# Altium schematic sheet [4] - POWER (CONT).SchDoc: REGULATORS
size B; Organization: Altium Limited; Address1: L3, 12a Rodborough Rd; Address2: Frenchs Forest; Address3: NSW; Address4: Australia 2086; DocumentNumber: 4; Revision: V1I1; SheetNumber: 4; SheetTotal: 16
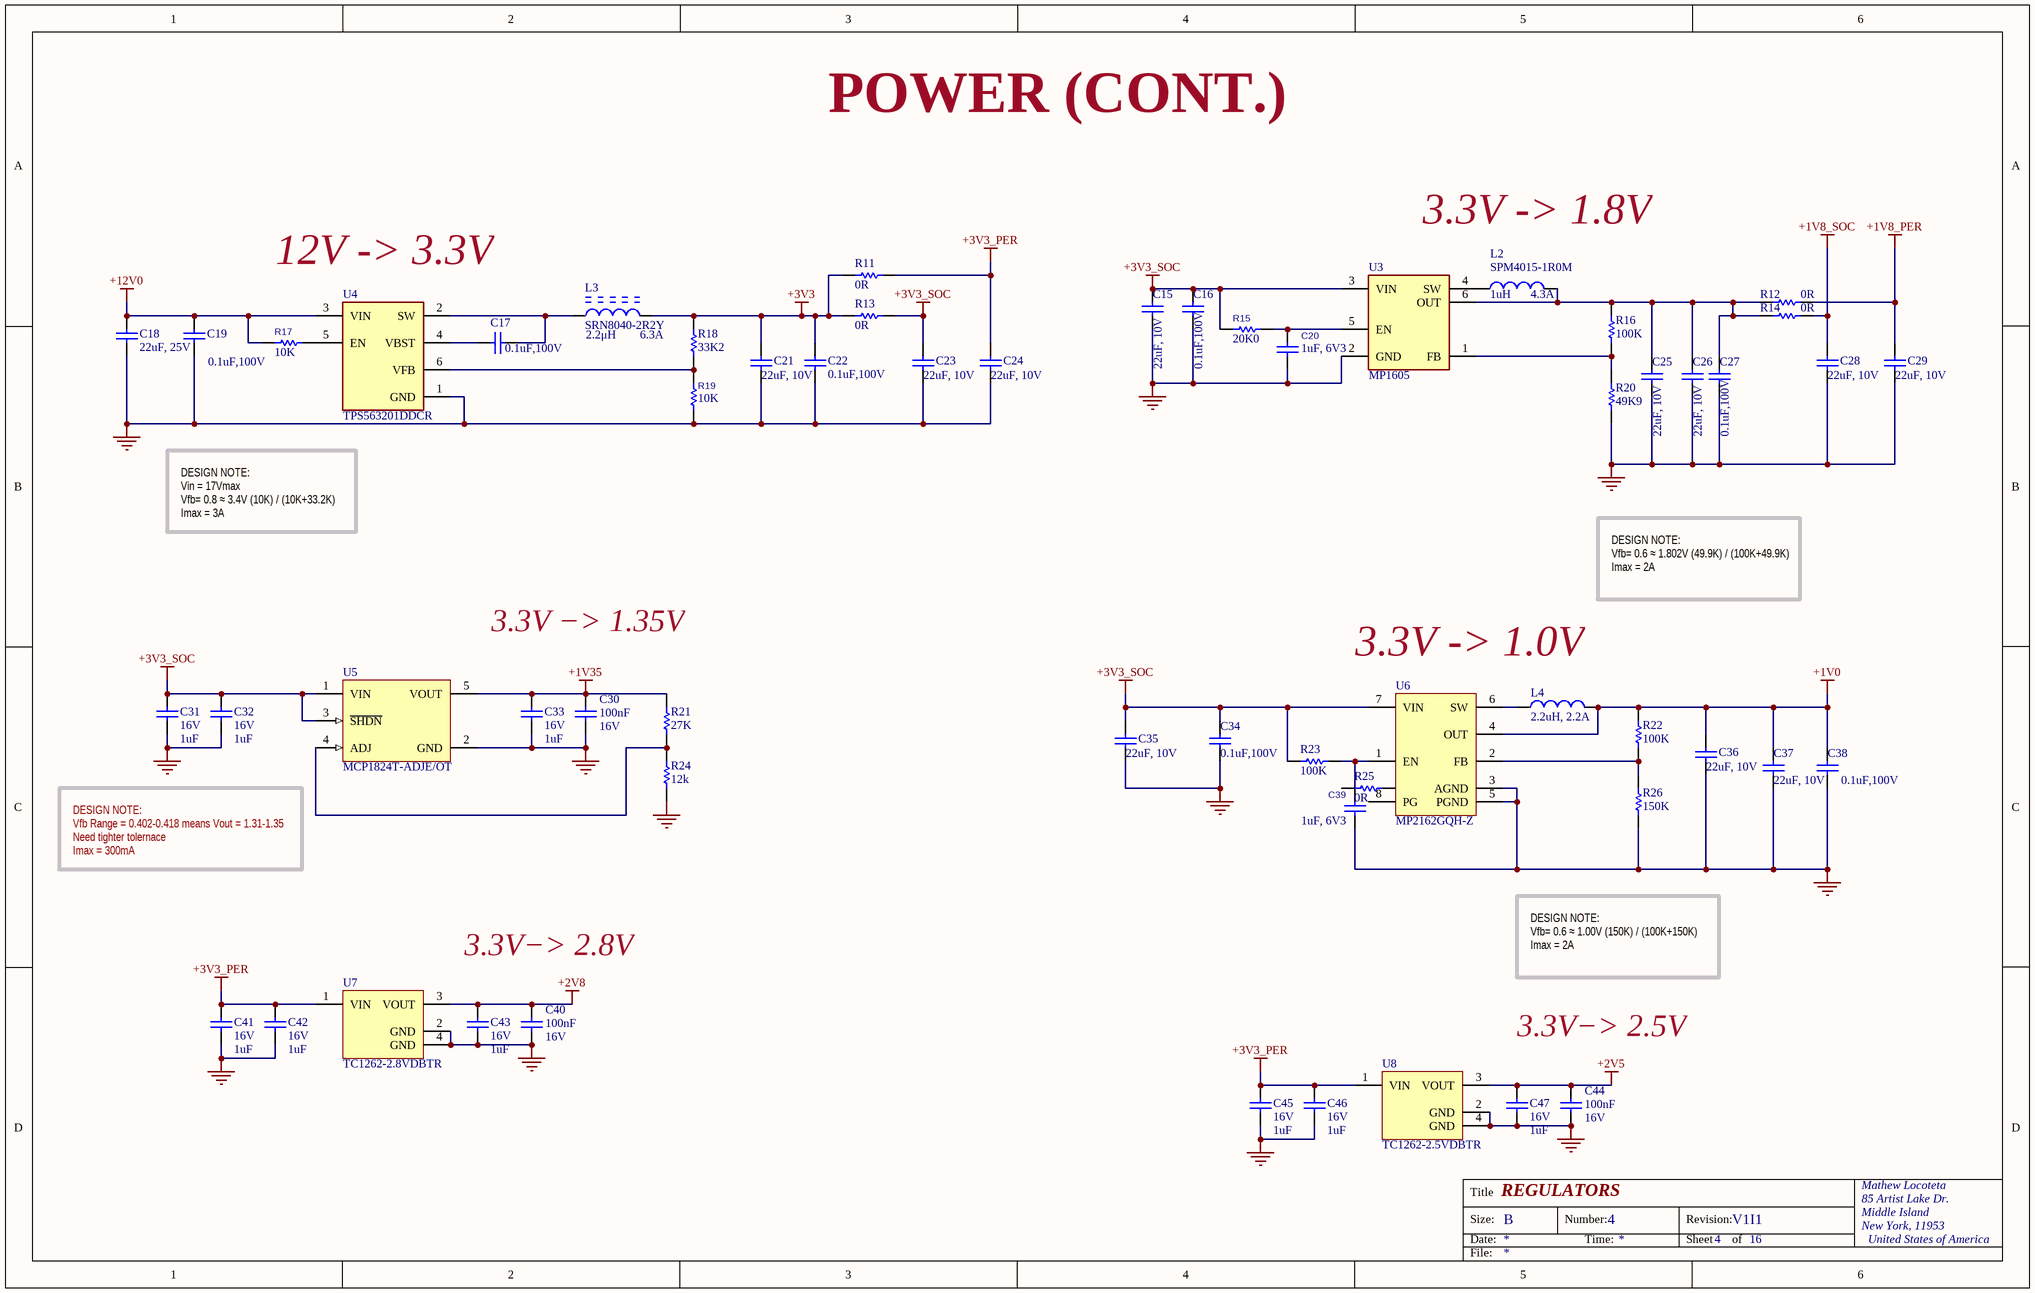
[diagram p0: [4] - POWER (CONT).SchDoc]

## Parts
C15  22uF, 10V  [C0805]
C16  0.1uF,100V  [C0805]
C17  0.1uF,100V  [C0805]
C18  22uF, 25V  [C1210]
C19  0.1uF,100V  [C0805]
C20  1uF, 6V3  [C0402]
C21  22uF, 10V  [C0805]
C22  0.1uF,100V  [C0805]
C23  22uF, 10V  [C0805]
C24  22uF, 10V  [C0805]
C25  22uF, 10V  [C0805]
C26  22uF, 10V  [C0805]
C27  0.1uF,100V  [C0805]
C28  22uF, 10V  [C0805]
C29  22uF, 10V  [C0805]
C30  Capacitance: 100nF  Voltage Rating: 16V  [C0402]  (hidden comment: 0.1uF,16V)
C31  Voltage Rating: 16V  [C0603]  (hidden comment: 1uF)
C32  Voltage Rating: 16V  [C0603]  (hidden comment: 1uF)
C33  Voltage Rating: 16V  [C0603]  (hidden comment: 1uF)
C34  0.1uF,100V  [C0805]
C35  22uF, 10V  [C0805]
C36  22uF, 10V  [C0805]
C37  22uF, 10V  [C0805]
C38  0.1uF,100V  [C0805]
C39  1uF, 6V3  [C0402]
C40  Capacitance: 100nF  Voltage Rating: 16V  [C0402]  (hidden comment: 0.1uF,16V)
C41  Voltage Rating: 16V  [C0603]  (hidden comment: 1uF)
C42  Voltage Rating: 16V  [C0603]  (hidden comment: 1uF)
C43  Voltage Rating: 16V  [C0603]  (hidden comment: 1uF)
C44  Capacitance: 100nF  Voltage Rating: 16V  [C0402]  (hidden comment: 0.1uF,16V)
C45  Voltage Rating: 16V  [C0603]  (hidden comment: 1uF)
C46  Voltage Rating: 16V  [C0603]  (hidden comment: 1uF)
C47  Voltage Rating: 16V  [C0603]  (hidden comment: 1uF)
L2  SPM4015-1R0M  Inductance: 1uH  Current Rating: 4.3A
L3  SRN8040-2R2Y  Current, Rating: 6.3A  Inductance: 2.2μH  [BOUR-SRN8040_V]
L4  2.2uH, 2.2A
R11  0R  [r0805]
R12  0R  [r0805]
R13  0R  [r0805]
R14  0R  [r0805]
R15  20K0  [R0402]
R16  100K  [R0402]
R17  10K  [R0402]
R18  33K2  [R0402]
R19  10K  [R0402]
R20  49K9  [R0402]
R21  27K  [RESC1005X40X25ML05T05]
R22  Resistance: 100K  [RESC1005X40X25LL05T05]  (hidden comment: ERJ-2RKF1003X)
R23  100K  [R0402]
R24  12k  [RESC1005X40X25NL05T05]
R25  0R  [r0805]
R26  150K  [R0402]
U3  MP1605
U4  TPS563201DDCR
U5  MCP1824T-ADJE/OT  [SOT-23-OT5_M]
U6  MP2162GQH-Z
U7  TC1262-2.8VDBTR  [SOT-223-DB3_N]
U8  TC1262-2.5VDBTR  [SOT-223-DB3_M]

## Nets
+1V0: C36.2 C37.2 C38.2 L4.2 R22.2 U6.4(OUT)
+1V8_PER: C29.2 R12.2
+1V8_SOC: C28.2 R14.2
+1V35: C30.1 C33.2 R21.2 U5.5(VOUT)
+2V5: C44.1 C47.2 U8.3(VOUT)
+2V8: C40.1 C43.2 U7.3(VOUT)
+3V3: C21.2 C22.1 L3.2 R11.2 R13.2 R18.2
+3V3_PER: C24.2 C41.2 C42.2 C45.2 C46.2 R11.1 U7.1(VIN) U8.1(VIN)
+3V3_SOC: C15.2 C16.1 C23.2 C31.2 C32.2 C34.1 C35.2 R13.1 R15.2 R23.1 U3.3(VIN) U5.1(VIN) U5.3(~{SHDN}) U6.7(VIN)
+12V0: C18.2 C19.2 R17.1 U4.3(VIN)
GND: C15.1 C16.2 C18.1 C19.1 C20.1 C21.1 C22.2 C23.1 C24.1 C25.1 C26.1 C27.2 C28.1 C29.1 C30.2 C31.1 C32.1 C33.1 C34.2 C35.1 C36.1 C37.1 C38.1 C39.1 C40.2 C41.1 C42.1 C43.1 C44.2 C45.1 C46.1 C47.1 R19.1 R20.1 R24.1 R26.1 U3.2(GND) U4.1(GND) U5.2(GND) U6.3(AGND) U6.5(PGND) U7.2(GND) U7.4(GND) U8.2(GND) U8.4(GND)
NetC17_1: C17.1 L3.1 U4.2(SW)
NetC17_2: C17.2 U4.4(VBST)
NetC20_2: C20.2 R15.1 U3.5(EN)
NetC25_2: C25.2 C26.2 C27.1 L2.2 R12.1 R14.1 R16.2 U3.6(OUT)
NetC39_2: C39.2 R23.2 U6.1(EN)
NetL2_1: L2.1 U3.4(SW)
NetL4_1: L4.1 U6.6(SW)
NetR16_1: R16.1 R20.2 U3.1(FB)
NetR17_2: R17.2 U4.5(EN)
NetR18_1: R18.1 R19.2 U4.6(VFB)
NetR21_1: R21.1 R24.2 U5.4(ADJ)
NetR22_1: R22.1 R26.2 U6.2(FB)

Not connected (* = marked no-connect by the designer): R25 1 2; U6 8(PG)

## Notes on the sheet
- POWER (CONT.)
- 3.3V -> 1.8V
- (near U4) 12V -> 3.3V
- DESIGN NOTE:
  Vin = 17Vmax
  Vfb= 0.8 ≈ 3.4V (10K) / (10K+33.2K)
  Imax = 3A
- 3.3V −> 1.35V
- DESIGN NOTE:
  Vfb= 0.6 ≈ 1.802V (49.9K) / (100K+49.9K)
  Imax = 2A
- 3.3V -> 1.0V
- DESIGN NOTE:
  Vfb Range = 0.402-0.418 means Vout = 1.31-1.35
  Need tighter tolernace
  Imax = 300mA
- 3.3V−> 2.8V
- DESIGN NOTE:
  Vfb= 0.6 ≈ 1.00V (150K) / (100K+150K)
  Imax = 2A
- 3.3V−> 2.5V
- Title
- Size:
- Date:
- B
- Number:
- Time:
- Revision:
- Sheet
- of
- Mathew Locoteta
- 85 Artist Lake Dr.
- Middle Island
- New York, 11953
- United States of America
- File:

## Library data of the parts
C15 C21 C23-C26 C28 C29 C35-C37 = GRM21BR61A226ME51L: MURATA - GRM21BR61A226ME51L - CAP, MLCC, X5R, 22UF, 10V, 0805; Tolerance: 20%; Supplier 1: Digi-Key; Manufacturer: Murata; Manufacturer Part Number: GRM21BR61A226ME51L; RoHS: Yes; Category: Ceramic Capacitors; Stock 1: 2854415; Pricing 1: 1=0.36000, 10=0.24400, 100=0.13810, 500=0.09746, 1000=0.08529 (USD); Mount: Surface Mount; Case/Package: 0805; Weight: 0.000335oz; Case Code (Imperial): 0805; Case Code (Metric): 2012; Min Operating Temperature: -55°C; Max Operating Temperature: 85°C; Dielectric: X5R; Termination: SMD/SMT; Voltage Rating (DC): 10V; Package Quantity: 3000; Capacitance: 22uF; Packaging: Tape and Reel; Voltage Rating: 10V; Length: 2mm; Height: 1.25mm; Width: 0.049inch; Thickness: 0.055inch; Depth: 1.25mm; Radiation Hardening: No; Lead Free: Lead Free; REACH SVHC: No SVHC; ComponentLink1URL: http://www.farnell.com/datasheets/1955716.pdf?src-supplier=Farnell; ComponentLink1Description: http://www.farnell.com/datasheets/1955716.pdf?src-supplier=Farnell; ComponentLink2URL: http://components.arrow.com/part/dataview/0323_06961245?src-supplier=Arrow+Europe; ComponentLink2Description: http://components.arrow.com/part/dataview/0323_06961245?src-supplier=Arrow+Europe; ComponentLink3URL: http://www.mouser.com/ds/2/281/c02e-2905.pdf?src-supplier=Mouser; ComponentLink3Description: http://www.mouser.com/ds/2/281/c02e-2905.pdf?src-supplier=Mouser; ComponentLink4URL: http://psearch.en.murata.com/capacitor/product/GRM21BR61A226ME51%23.html?src-supplier=Avnet; ComponentLink4Description: http://psearch.en.murata.com/capacitor/product/GRM21BR61A226ME51%23.html?src-supplier=Avnet; ComponentLink5URL: http://www.farnell.com/datasheets/1955716.pdf?src-supplier=Element14; ComponentLink5Description: http://www.farnell.com/datasheets/1955716.pdf?src-supplier=Element14; ComponentLink6URL: http://search.murata.co.jp/Ceramy/image/img/A01X/G101/ENG/GRM21BR61A226ME51-01.pdf?src-supplier=Digi-Key; ComponentLink6Description: http://search.murata.co.jp/Ceramy/image/img/A01X/G101/ENG/GRM21BR61A226ME51-01.pdf?src-supplier=Digi-Key; ComponentLink7URL: http://www.farnell.com/datasheets/1955716.pdf?src-supplier=Newark; ComponentLink7Description: http://www.farnell.com/datasheets/1955716.pdf?src-supplier=Newark; Supplier Part Number 1: 490-10511-6-ND
C16 C17 C19 C22 C27 C34 C38 = CL21B104KCFWPNE: CAP CER 0.1UF 100V X7R 0805; Manufacturer: Samsung; Capacitance: 100nF; Tolerance: 10%; Supplier 1: Digi-Key; Manufacturer Part Number: CL21B104KCFWPNE; Stock 1: 283289; Pricing 1: 1=0.16000, 10=0.11200, 100=0.05250, 500=0.03684, 1000=0.03050 (USD); RoHS: Yes; Mount: Surface Mount; Case/Package: 0805; Case Code (Metric): 2012; Case Code (Imperial): 0805; Min Operating Temperature: -55°C; Max Operating Temperature: 125°C; Packaging: Tape and Reel; Voltage Rating: 100V; Features: Soft Termination; Length: 0.079inch; Width: 0.049inch; Thickness: 0.053inch; Ratings: AEC-Q200; ComponentLink1URL: http://www.samsungsem.com/servlet/FileDownload?type=spec&file=CL21B104KCFWPNE.pdf&src-supplier=Avnet; ComponentLink1Description: http://www.samsungsem.com/servlet/FileDownload?type=spec&file=CL21B104KCFWPNE.pdf&src-supplier=Avnet; ComponentLink2URL: http://www.samsungsem.com/kr/support/product-search/mlcc/CL21B104KCFWPNE.jsp?src-supplier=Digi-Key; ComponentLink2Description: http://www.samsungsem.com/kr/support/product-search/mlcc/CL21B104KCFWPNE.jsp?src-supplier=Digi-Key; Supplier Part Number 1: 1276-6733-1-ND
C18 = TMK325B7226MMHP: 22µF ±20% 25V Ceramic Capacitor X7R 1210 (3225 Metric) /; Manufacturer: Taiyo Yuden; Supplier 1: Digi-Key; Manufacturer Part Number: TMK325B7226MMHP; RoHS: No; Stock 1: 1378; Pricing 1: 1=0.84000, 10=0.64100, 100=0.45870, 500=0.35514 (USD); Supplier Part Number 1: 587-TMK325B7226MMHPCT-ND
C20 C39 = GRT155R70J105KE01D: MURATA - GRT155R70J105KE01D - CAP, 1µF, 6.3V, 10%, X7R, 0402; Supplier 1: Digi-Key; Manufacturer: Murata; Manufacturer Part Number: GRT155R70J105KE01D; Stock 1: 1473; Pricing 1: 1=0.14000, 10=0.10000, 100=0.04680, 500=0.03282, 1000=0.02718, 2500=0.02529, 5000=0.02314 (USD); RoHS: No; ComponentLink1URL: http://www.farnell.com/datasheets/2166063.pdf?src-supplier=Farnell; ComponentLink1Description: http://www.farnell.com/datasheets/2166063.pdf?src-supplier=Farnell; Supplier Part Number 1: 490-18216-1-ND
C30 C40 C44 = CL05B104KO5VPNC: CAP CER 0.1UF 16V X7R 0402; Manufacturer: Samsung; Tolerance: 10%; Supplier 1: Digi-Key; Manufacturer Part Number: CL05B104KO5VPNC; Stock 1: 940680; Pricing 1: 1=0.10000, 10=0.02600, 100=0.01140, 500=0.00812, 1000=0.00638, 2500=0.00580, 5000=0.00534 (USD); RoHS: Yes; Mount: Surface Mount; Case/Package: 0402; Case Code (Metric): 1005; Case Code (Imperial): 0402; Min Operating Temperature: -55°C; Max Operating Temperature: 125°C; Packaging: Cut Tape; Features: Soft Termination; Length: 0.039inch; Width: 0.02inch; Thickness: 0.022inch; Ratings: AEC-Q200; Lead Free: Lead Free; ComponentLink1URL: http://components.arrow.com/part/dataview/0323_06933256?src-supplier=Arrow+Europe; ComponentLink1Description: http://components.arrow.com/part/dataview/0323_06933256?src-supplier=Arrow+Europe; ComponentLink2URL: http://www.samsungsem.com/kr/support/library/product-catalog/mlcc.jsp?src-supplier=Digi-Key; ComponentLink2Description: http://www.samsungsem.com/kr/support/library/product-catalog/mlcc.jsp?src-supplier=Digi-Key; ComponentLink3URL: http://www.farnell.com/datasheets/2710692.pdf?src-supplier=Newark; ComponentLink3Description: http://www.farnell.com/datasheets/2710692.pdf?src-supplier=Newark; ComponentLink4URL: http://www.samsungsem.com/kr/support/product-search/mlcc/CL05B104KO5VPNC.jsp?src-supplier=Digi-Key; ComponentLink4Description: http://www.samsungsem.com/kr/support/product-search/mlcc/CL05B104KO5VPNC.jsp?src-supplier=Digi-Key; ComponentLink5URL: http://www.samsungsem.com/servlet/FileDownload?type=spec&file=CL05B104KO5VPNC.pdf&src-supplier=Avnet; ComponentLink5Description: http://www.samsungsem.com/servlet/FileDownload?type=spec&file=CL05B104KO5VPNC.pdf&src-supplier=Avnet; Supplier Part Number 1: 1276-6844-1-ND
C31-C33 C41-C43 C45-C47 = EMK107B7105KAHT: Multilayer Ceramic Capacitors MLCC - SMD/SMT 1uF 16V X7R +/-10% 0603 AEC-Q200; Manufacturer: Taiyo Yuden; Tolerance: 10%; Supplier 1: Digi-Key; Manufacturer Part Number: EMK107B7105KAHT; RoHS: Yes; Category: Ceramic Capacitors; Stock 1: 123087; Pricing 1: 1=0.11000, 10=0.07500, 100=0.03520, 500=0.02470, 1000=0.02044 (USD); Mount: Surface Mount; Case/Package: 0603; Case Code (Metric): 1608; Case Code (Imperial): 0603; Min Operating Temperature: -55°C; Max Operating Temperature: 125°C; Dielectric: X7R; Termination: SMD/SMT; Package Quantity: 4000; Packaging: Tape and Reel; Voltage Rating (DC): 16V; Length: 0.063inch; Height: 0.8mm; Thickness: 0.035inch; Width: 0.031inch; Ratings: AEC-Q200; Lead Free: Lead Free; Halogen Free: Halogen Free; ComponentLink1URL: http://www.mouser.com/ds/2/396/mlcc11_hq_e-541564.pdf?src-supplier=Mouser; ComponentLink1Description: http://www.mouser.com/ds/2/396/mlcc11_hq_e-541564.pdf?src-supplier=Mouser; ComponentLink2URL: http://ds.yuden.co.jp/TYCOMPAS/ut/detail.do?productNo=EMK107B7105KAHT&fileName=EMK107B7105KAHT_SS&mode=specSheetDownload&src-supplier=Digi-Key; ComponentLink2Description: http://ds.yuden.co.jp/TYCOMPAS/ut/detail.do?productNo=EMK107B7105KAHT&fileName=EMK107B7105KAHT_SS&mode=specSheetDownload&src-supplier=Digi-Key; ComponentLink3URL: http://www.yuden.co.jp/ut/product/category/capacitor/putpdf/EMK107B7105KAHT.pdf?src-supplier=Avnet; ComponentLink3Description: http://www.yuden.co.jp/ut/product/category/capacitor/putpdf/EMK107B7105KAHT.pdf?src-supplier=Avnet; Supplier Part Number 1: 587-3305-1-ND; Capacitance: 1uF
L2 = SPM4015-1R0M: Fixed Inductors 1.0uH 39mOhms 6.7A 4.4x4.1x1.5mm; Manufacturer: TDK; Core Material: Metal; Shielding: Shielded; DC Resistance (DCR): 39.6mR; Test Frequency: 100kHz; Tolerance: 20%; Supplier 1: Digi-Key; Manufacturer Part Number: SPM4015-1R0M; RoHS: Yes; Category: Fixed Inductors; Stock 1: 498; Pricing 1: 1=1.52000, 10=1.40800, 100=1.01830, 500=0.77998 (USD); Mount: Surface Mount; Case/Package: Nonstandard; Weight: 0.003527oz; Min Operating Temperature: -40°C; Max Operating Temperature: 125°C; Packaging: Tape and Reel; Composition: Wirewound; Saturation Current: 6.7A; Termination: SMD/SMT; Max DC Current: 6.7A; Package Quantity: 1000; Length: 0.173inch; Height: 1.5mm; Width: 0.161inch; Height - Seated (Max): 0.059inch; ComponentLink1URL: http://www.mouser.com/ds/2/400/nductor_commercial_power_spm4015_en-838413.pdf?src-supplier=Mouser; ComponentLink1Description: http://www.mouser.com/ds/2/400/nductor_commercial_power_spm4015_en-838413.pdf?src-supplier=Mouser; ComponentLink2URL: https://product.tdk.com/info/en/documents/catalog/inductor_commercial_power_spm4015_en.pdf?src-supplier=Digi-Key; ComponentLink2Description: https://product.tdk.com/info/en/documents/catalog/inductor_commercial_power_spm4015_en.pdf?src-supplier=Digi-Key; Supplier Part Number 1: 445-172364-1-ND
L3 = CMP-2000-07144-1: Semi-Shielded Power Inductor, 2.2 uH, +/- 30%, 6.3 A, -40 to 125 degC, 2-Pin SMD, RoHS, Tape and Reel; Manufacturer: Bourns; Brand/Series: SRN8040Series; Type: Power; Datasheet Version: 05/2015; Mounting Technology: SurfaceMount; Tolerance: ±30%; Datasheet URL: http://www.bourns.com/docs/Product-Datasheets/SRN8040.pdf; Package Reference: SRN8040; Termination: SMD; Manufacturer URL: http://www.bourns.com/; Package Description: 2-Pin Surface Mounted Device, Body 8 x 8 mm
L4 = 1239AS-H-2R2M=P2: FIXED IND 2.2UH 2.2A 108 MOHM; Manufacturer: Murata; Core Material: Ferrite; Shielding: Shielded; DC Resistance (DCR): 108mR; Test Frequency: 1MHz; Tolerance: 20%; Supplier 1: Digi-Key; Manufacturer Part Number: 1239AS-H-2R2M=P2; RoHS: Yes; Category: Fixed Inductors; Stock 1: 3002; Pricing 1: 1=0.42000, 10=0.37700, 100=0.25930, 500=0.22160, 1000=0.16974 (USD); Mount: Surface Mount; Case/Package: 1008; Case Code (Metric): 2520; Case Code (Imperial): 1008; Min Operating Temperature: -40°C; Max Operating Temperature: 85°C; Packaging: Tape and Reel; Composition: Wirewound; Inductance: 2.2uH; Current Rating: 2.2A; Length: 0.098inch; Width: 0.079inch; Height - Seated (Max): 0.047inch; ComponentLink1URL: https://www.murata.com/~/media/webrenewal/products/inductor/chip/tokoproducts/wirewoundmetalalloychiptype/m_dfe252012c.ashx?src-supplier=Digi-Key; ComponentLink1Description: https://www.murata.com/~/media/webrenewal/products/inductor/chip/tokoproducts/wirewoundmetalalloychiptype/m_dfe252012c.ashx?src-supplier=Digi-Key; Supplier Part Number 1: 490-10566-1-ND
R11-R14 R25 = RMCF0805ZT0R00: STACKPOLE ELECTRONICS - RMCF0805ZT0R00. - RES THKFLM 0805 0 OHM JUMPER 1/8W 200PPM/ C SMD ROHS COMPLIANT: YES; Resistance: 0mR; Power Rating: 125mW; Imax: 2A; Supplier 1: Digi-Key; Manufacturer: Stackpole Electronics; Manufacturer Part Number: RMCF0805ZT0R00; RoHS: Yes; Category: Chip SMD Resistors; Stock 1: 11365; Pricing 1: 1=0.10000, 10=0.01900, 25=0.01400, 50=0.01060, 100=0.00780, 250=0.00596, 500=0.00476, 1000=0.00350 (USD); Mount: Surface Mount; Case/Package: 0805; Case Code (Metric): 2012; Case Code (Imperial): 0805; Contact Plating: Tin,Matte; Min Operating Temperature: -55°C; Max Operating Temperature: 155°C; Packaging: Tape and Reel; Features: Automotive AEC-Q200; Composition: Thick Film; Number of Terminations: 2; Military Standard: Not; Max Power Dissipation: 125mW; Length: 2mm; Height: 0.026inch; Width: 0.049inch; Depth: 1.25mm; Radiation Hardening: No; Lead Free: Lead Free; ComponentLink1URL: https://datasheet.ciiva.com/15193/getdatasheetpartid-360417-15193658.pdf?src-supplier=Verical; ComponentLink1Description: https://datasheet.ciiva.com/15193/getdatasheetpartid-360417-15193658.pdf?src-supplier=Verical; Supplier Part Number 1: RMCF0805ZT0R00CT-ND
R15 = RMCF0402FT20K0: RES 20K OHM 1% 1/16W 0402; Manufacturer 1: Stackpole Electronics; Resistance: 20kR; Max Power Dissipation: 63mW; Temperature Coefficient: 100ppm/°C; Supplier 1: Future Electronics; Manufacturer Part Number 1: RMCF0402FT20K0; Stock 1: 6575; Pricing 1: 1=0.00380, 500=0.00280, 1500=0.00260, 2500=0.00250, 5000=0.00250 (USD); RoHS: Yes; Mount: Surface Mount; Case/Package: 0402; Case Code (Metric): 1005; Case Code (Imperial): 0402; Contact Plating: Tin,Matte; Min Operating Temperature: -55°C; Max Operating Temperature: 155°C; Tolerance: 1%; Packaging: Tape and Reel; Composition: Thick Film; Number of Terminations: 2; Features: Automotive AEC-Q200; Length: 0.039inch; Height: 0.016inch; Width: 0.02inch; Radiation Hardening: No; Lead Free: Lead Free; ComponentLink1URL: http://components.arrow.com/part/dataview/40959032S7284943N1174?src-supplier=Arrow; ComponentLink1Description: http://components.arrow.com/part/dataview/40959032S7284943N1174?src-supplier=Arrow; ComponentLink2URL: https://www.seielect.com/catalog/sei-rmcf_rmcp.pdf?src-supplier=Digi-Key; ComponentLink2Description: https://www.seielect.com/catalog/sei-rmcf_rmcp.pdf?src-supplier=Digi-Key; ComponentLink3URL: https://www.seielect.com/catalog/SEI-RMCF_RMCP.pdf?src-supplier=Avnet; ComponentLink3Description: https://www.seielect.com/catalog/SEI-RMCF_RMCP.pdf?src-supplier=Avnet; Supplier Part Number 1: RMCF0402FT20K0-CUTT
R16 R23 = RMCF0402FT100K: RES 100K OHM 1% 1/16W 0402; Manufacturer: Stackpole Electronics; Resistance: 100kR; Power Rating: 62.5mW; Temperature Coefficient: 100ppm/°C; Max Power Dissipation: 63mW; Supplier 1: Digi-Key; Manufacturer Part Number: RMCF0402FT100K; Stock 1: 1382397; Pricing 1: 1=0.10000, 10=0.01500, 100=0.00610, 1000=0.00275, 2500=0.00239, 5000=0.00198 (USD); RoHS: Yes; Mount: Surface Mount; Case/Package: 0402; Case Code (Metric): 1005; Case Code (Imperial): 0402; Contact Plating: Tin,Matte; Min Operating Temperature: -55°C; Max Operating Temperature: 155°C; Tolerance: 1%; Packaging: Tape and Reel; Composition: Thick Film; Number of Terminations: 2; Military Standard: Not; Features: Automotive AEC-Q200; Length: 1mm; Height: 0.016inch; Width: 0.02inch; Depth: 0.5mm; Radiation Hardening: No; Lead Free: Lead Free; ComponentLink1URL: https://datasheet.ciiva.com/15193/getdatasheetpartid-482656-15193415.pdf?src-supplier=Verical; ComponentLink1Description: https://datasheet.ciiva.com/15193/getdatasheetpartid-482656-15193415.pdf?src-supplier=Verical; Supplier Part Number 1: RMCF0402FT100KCT-ND
R17 R19 = RMCF0402FT10K0: RES 10K OHM 1% 1/16W 0402; Manufacturer: Stackpole Electronics; Resistance: 10kR; Power Rating: 62.5mW; Temperature Coefficient: 100ppm/°C; Max Power Dissipation: 63mW; Supplier 1: Digi-Key; Manufacturer Part Number: RMCF0402FT10K0; Stock 1: 6276240; Pricing 1: 1=0.10000, 10=0.01500, 100=0.00610, 1000=0.00275, 2500=0.00239, 5000=0.00198 (USD); RoHS: Yes; Mount: Surface Mount; Case/Package: 0402; Case Code (Metric): 1005; Case Code (Imperial): 0402; Contact Plating: Tin,Matte; Min Operating Temperature: -55°C; Max Operating Temperature: 155°C; Tolerance: 1%; Packaging: Tape and Reel; Composition: Thick Film; Number of Terminations: 2; Military Standard: Not; Features: Automotive AEC-Q200; Length: 1mm; Height: 0.016inch; Width: 0.02inch; Depth: 0.5mm; Radiation Hardening: No; Lead Free: Lead Free; ComponentLink1URL: https://datasheet.ciiva.com/24341/sei-rmcp-24341800.pdf?src-supplier=Onlinecomponents.com; ComponentLink1Description: https://datasheet.ciiva.com/24341/sei-rmcp-24341800.pdf?src-supplier=Onlinecomponents.com; Supplier Part Number 1: RMCF0402FT10K0DKR-ND
R18 = RMCF0402FT33K2: RES 33.2K OHM 1% 1/16W 0402; Manufacturer: Stackpole Electronics; Resistance: 33.2kR; Max Power Dissipation: 63mW; Temperature Coefficient: 100ppm/°C; Supplier 1: Digi-Key; Manufacturer Part Number: RMCF0402FT33K2; RoHS: Yes; Category: Chip SMD Resistors; Stock 1: 84886; Pricing 1: 1=0.10000, 10=0.01400, 100=0.00580, 1000=0.00262, 2500=0.00228, 5000=0.00188 (USD); Mount: Surface Mount; Case/Package: 0402; Case Code (Metric): 1005; Case Code (Imperial): 0402; Contact Plating: Tin,Matte; Min Operating Temperature: -55°C; Max Operating Temperature: 155°C; Tolerance: 1%; Packaging: Tape and Reel; Composition: Thick Film; Number of Terminations: 2; Features: Automotive AEC-Q200; Length: 0.039inch; Height: 0.016inch; Width: 0.02inch; Radiation Hardening: No; Lead Free: Lead Free; ComponentLink1URL: http://components.arrow.com/part/dataview/50580729S9600560N1174?src-supplier=Arrow; ComponentLink1Description: http://components.arrow.com/part/dataview/50580729S9600560N1174?src-supplier=Arrow; ComponentLink2URL: https://www.seielect.com/catalog/SEI-RMCF_RMCP.pdf?src-supplier=Avnet; ComponentLink2Description: https://www.seielect.com/catalog/SEI-RMCF_RMCP.pdf?src-supplier=Avnet; ComponentLink3URL: https://www.seielect.com/catalog/SEI-Packaging.pdf?src-supplier=Digi-Key; ComponentLink3Description: https://www.seielect.com/catalog/SEI-Packaging.pdf?src-supplier=Digi-Key; ComponentLink4URL: https://www.seielect.com/Catalog/SEI-RMCF_RMCP.pdf?src-supplier=Digi-Key; ComponentLink4Description: https://www.seielect.com/Catalog/SEI-RMCF_RMCP.pdf?src-supplier=Digi-Key; Supplier Part Number 1: RMCF0402FT33K2CT-ND
R20 = RMCF0402FT49K9: STACKPOLE ELECTRONICS - RMCF0402FT49K9. - RES THKFLM 0402 49.9K OHM 1% 1/16W 100PPM/ C SMD ROHS COMPLIANT: YES; Resistance: 49.9kR; Power Rating: 63mW; Temperature Coefficient: 100ppm/°C; Supplier 1: Digi-Key; Manufacturer: Stackpole Electronics; Manufacturer Part Number: RMCF0402FT49K9; RoHS: Yes; Category: Chip SMD Resistors; Stock 1: 228290; Pricing 1: 1=0.10000, 10=0.01400, 100=0.00580, 1000=0.00262, 2500=0.00228, 5000=0.00188 (USD); Mount: Surface Mount; Case/Package: 0402; Case Code (Imperial): 0402; Contact Plating: Tin,Matte; Case Code (Metric): 1005; Min Operating Temperature: -55°C; Max Operating Temperature: 155°C; Composition: Thick Film; Number of Terminations: 2; Tolerance: 1%; Features: Automotive AEC-Q200; Packaging: Tape and Reel; Max Power Dissipation: 63mW; Length: 0.039inch; Height: 0.016inch; Width: 0.02inch; Radiation Hardening: No; Lead Free: Lead Free; ComponentLink1URL: http://components.arrow.com/part/dataview/50597436S9743292N1174?src-supplier=Arrow; ComponentLink1Description: http://components.arrow.com/part/dataview/50597436S9743292N1174?src-supplier=Arrow; ComponentLink2URL: http://seielect.com/Catalog/SEI-RMC.pdf?src-supplier=Future+Electronics; ComponentLink2Description: http://seielect.com/Catalog/SEI-RMC.pdf?src-supplier=Future+Electronics; ComponentLink3URL: https://www.seielect.com/catalog/SEI-RMCF_RMCP.pdf?src-supplier=Avnet; ComponentLink3Description: https://www.seielect.com/catalog/SEI-RMCF_RMCP.pdf?src-supplier=Avnet; ComponentLink4URL: https://www.seielect.com/catalog/SEI-Packaging.pdf?src-supplier=Digi-Key; ComponentLink4Description: https://www.seielect.com/catalog/SEI-Packaging.pdf?src-supplier=Digi-Key; ComponentLink5URL: https://www.seielect.com/Catalog/SEI-RMCF_RMCP.pdf?src-supplier=Digi-Key; ComponentLink5Description: https://www.seielect.com/Catalog/SEI-RMCF_RMCP.pdf?src-supplier=Digi-Key; Supplier Part Number 1: RMCF0402FT49K9CT-ND
R21 = CMP-2002-08431-1: Part Number: CRCW040227K0FKED; Manufacturer: Vishay Dale
R22 = CMP-2002-00608-3: Chip Resistor, 100 KOhm, +/- 1%, 100 mW, -55 to 155 degC, 0402 (1005 Metric), RoHS, Tape and Reel; Manufacturer: Basic Passives; Power Rating: 100 mW; Voltage Rating: 50 V; Case\/Package: 0402; Case Code (Imperial): 0402; RoHSCompliant: true; Min Operating Temperature: -55 degC; Mount: Surface Mount; Packaging: Tape and Reel; PackageDescription: 2-Pin Surface Mount Device, Body 1 x 0.5 mm; Tolerance: 1%; REACH SVHC: Yes; ComponentLink1URL: http://www.panasonic.com/; ComponentLink1Description: Manufacturer URL; Package Quantity: 10000; Mounting Technology: Surface Mount; DatasheetVersion: 04/2015; PartNumber: ERJ-2RKF1003X; Height: 0.35 mm; Pins: 2; Length: 1 mm; Max Operating Temperature: 155 degC; ComponentLink2Description: Datasheet; ComponentLink2URL: http://industrial.panasonic.com/cdbs/www-data/pdf/RDA0000/AOA0000C86.pdf; PackageReference: 0402; Radiation Hardening: No; Width: 0.5 mm; Case Code (Metric): 1005
R24 = CMP-2002-08177-1: Part Number: CRCW040212K0FKED; Manufacturer: Vishay Dale
R26 = RMCF0402FT150K: RES 150K OHM 1% 1/16W 0402; Manufacturer: Stackpole Electronics; Max Power Dissipation: 63mW; Temperature Coefficient: 100ppm/°C; Resistance: 150kR; Supplier 1: Digi-Key; Manufacturer Part Number: RMCF0402FT150K; RoHS: Yes; Category: Chip SMD Resistors; Stock 1: 3183; Pricing 1: 1=0.10000, 10=0.01400, 100=0.00580, 1000=0.00262, 2500=0.00228, 5000=0.00188 (USD); Mount: Surface Mount; Case/Package: 0402; Case Code (Imperial): 0402; Contact Plating: Tin,Matte; Case Code (Metric): 1005; Min Operating Temperature: -55°C; Max Operating Temperature: 155°C; Composition: Thick Film; Number of Terminations: 2; Features: Automotive AEC-Q200; Packaging: Tape and Reel; Tolerance: 1%; Package Quantity: 10000; Length: 0.039inch; Height: 0.016inch; Width: 0.02inch; Radiation Hardening: No; Lead Free: Lead Free; ComponentLink1URL: http://components.arrow.com/part/dataview/50500954S9600494N1174?src-supplier=Arrow; ComponentLink1Description: http://components.arrow.com/part/dataview/50500954S9600494N1174?src-supplier=Arrow; ComponentLink2URL: https://www.seielect.com/catalog/SEI-RMCF_RMCP.pdf?src-supplier=Avnet; ComponentLink2Description: https://www.seielect.com/catalog/SEI-RMCF_RMCP.pdf?src-supplier=Avnet; ComponentLink3URL: https://www.seielect.com/catalog/SEI-Packaging.pdf?src-supplier=Digi-Key; ComponentLink3Description: https://www.seielect.com/catalog/SEI-Packaging.pdf?src-supplier=Digi-Key; Supplier Part Number 1: RMCF0402FT150KCT-ND
U3 = MP1605: Monolithic Step down,, 2 A , 2.3-5.5V 0.6Vmin out
U4 = TPS563201DDCR: IC REG BUCK ADJ 3A TSOT23-6; Manufacturer: Texas Instruments; Number of Outputs: 1; Min Input Voltage: 4.5V; Max Input Voltage: 17V; Min Output Voltage: 768mV; Max Output Voltage: 7V; Switching Frequency: 580kHz; Synchronous Rectifier: Yes; Quiescent Current: 400uA; Output Type: Adjustable; Output Configuration: Positive; Supplier 1: Digi-Key; Manufacturer Part Number: TPS563201DDCR; RoHS: Yes; Category: Power Supply Modules; Stock 1: 4338; Pricing 1: 1=0.92000, 10=0.81200, 25=0.76280, 100=0.57810, 250=0.49200, 500=0.46740, 1000=0.35670 (USD); Mount: Surface Mount; Case/Package: SOT-23-6; Number of Pins: 6; Min Operating Temperature: -40°C; Max Operating Temperature: 125°C; Packaging: Tape and Reel; Output Current: 3A; Lead Free: Lead Free; ComponentLink1URL: http://www.ti.com/lit/ds/symlink/tps563201.pdf?src-supplier=Digi-Key; ComponentLink1Description: http://www.ti.com/lit/ds/symlink/tps563201.pdf?src-supplier=Digi-Key; ComponentLink2URL: http://www.ti.com/general/docs/suppproductinfo.tsp?distId=10&amp;gotoUrl=http%3A%2F%2Fwww.ti.com%2Flit%2Fgpn%2Ftps563201&src-supplier=Digi-Key; ComponentLink2Description: http://www.ti.com/general/docs/suppproductinfo.tsp?distId=10&amp;gotoUrl=http%3A%2F%2Fwww.ti.com%2Flit%2Fgpn%2Ftps563201&src-supplier=Digi-Key; ComponentLink3URL: http://www.ti.com/lit/gpn/tps563201?src-supplier=Mouser; ComponentLink3Description: http://www.ti.com/lit/gpn/tps563201?src-supplier=Mouser; Supplier Part Number 1: 296-47238-1-ND
U5 = CMP-0136-00747-1: 300 mA, Low Voltage, Low Quiescent Current LDO Regulator, 5-Pin SOT-23, Extended Temperature, Tape and Reel; PackageVersion: revBB, Aug-2009; Code_IPC: SOT23-5; PackageDescription: 5-Lead Plastic Small Outline Transistor (OT) [SOT-23]; PackageReference: SOT-23-OT5; DatasheetVersion: revA, Aug-2007
U6 = MP2162GQH-Z: Conv DC-DC Single Step Down 2.5V 6V 8-Pin QFN EP T/R; Manufacturer: Monolithic Power Systems; Number of Outputs: 1; Max Output Current: 2A; Min Output Voltage: 600mV; Switching Frequency: 1.5MHz; Synchronous Rectifier: Yes; Output Type: Adjustable; Output Configuration: Positive; Supplier 1: Digi-Key; Manufacturer Part Number: MP2162GQH-Z; RoHS: Yes; Category: Voltage Regulators - Switching; Stock 1: 2891; Pricing 1: 1=1.73000, 10=1.55600, 25=1.46760, 100=1.17420, 250=1.02744, 500=0.99808, 1000=0.79259, 2500=0.76323 (USD); Mount: Surface Mount; Case/Package: QFN; Number of Pins: 8; Min Operating Temperature: -40°C; Max Operating Temperature: 125°C; Packaging: Tape and Reel; Package Quantity: 5000; Output Voltage: 6V; Min Input Voltage: 2.5V; Max Input Voltage: 6V; Max Output Voltage: 6V; Output Current: 2A; Operating Supply Voltage: 6V; Lead Free: Lead Free; ComponentLink1URL: http://www.mouser.com/ds/2/277/MP2162_r1.03-371781.pdf?src-supplier=Mouser; ComponentLink1Description: http://www.mouser.com/ds/2/277/MP2162_r1.03-371781.pdf?src-supplier=Mouser; ComponentLink2URL: https://www.monolithicpower.com/DesktopModules/DocumentManage/API/Document/GetDocument?id=537&src-supplier=Avnet; ComponentLink2Description: https://www.monolithicpower.com/DesktopModules/DocumentManage/API/Document/GetDocument?id=537&src-supplier=Avnet; ComponentLink3URL: http://www.monolithicpower.com/DesktopModules/DocumentManage/API/Document/getDocument?id=537&src-supplier=Digi-Key; ComponentLink3Description: http://www.monolithicpower.com/DesktopModules/DocumentManage/API/Document/getDocument?id=537&src-supplier=Digi-Key; Supplier Part Number 1: 1589-1570-1-ND
U7 = CMP-0136-00461-1: 500mA Fixed Output CMOS LDO, 3-Pin SOT-223, Extended Temperature, Tape and Reel; PackageDescription: 3-Lead Plastic Small Outline Transistor (DB) [SOT-223]; PackageReference: SOT-223-DB3; PackageVersion: revBB, Aug-2009; DatasheetVersion: revB, 2002
U8 = CMP-0136-00455-1: 500mA Fixed Output CMOS LDO, 3-Pin SOT-223, Extended Temperature, Tape and Reel; PackageDescription: 3-Lead Plastic Small Outline Transistor (DB) [SOT-223]; PackageVersion: revBB, Aug-2009; DatasheetVersion: revB, 2002; PackageReference: SOT-223-DB3